# EAGLE schematic ext_proto_M (EAGLE 9.6.2)
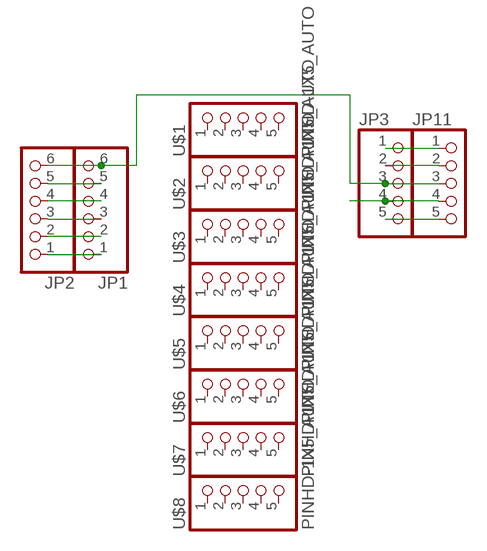
[diagram p0: schematic, sheet 1]

## Parts
JP1  PINHD-1X6  [1X06]
JP2  PINHD-1X6  [1X06]
JP3  PINHD-1X5  [1X05]
JP11  PINHD-1X5  [1X05]
U$1  PINHD-1X5_AUTO  [1X5_AUTO]
U$2  PINHD-1X5_AUTO  [1X5_AUTO]
U$3  PINHD-1X5_AUTO  [1X5_AUTO]
U$4  PINHD-1X5_AUTO  [1X5_AUTO]
U$5  PINHD-1X5_AUTO  [1X5_AUTO]
U$6  PINHD-1X5_AUTO  [1X5_AUTO]
U$7  PINHD-1X5_AUTO  [1X5_AUTO]
U$8  PINHD-1X5_AUTO  [1X5_AUTO]

## Nets
GND: JP1.6 JP2.6 JP3.3 JP11.3
N$1: JP1.5 JP2.5
N$2: JP1.4 JP2.4
N$3: JP1.3 JP2.3
N$4: JP1.2 JP2.2
N$5: JP1.1 JP2.1
N$6: JP3.5 JP11.5
N$7: JP3.2 JP11.2
N$8: JP3.1 JP11.1
VDD: JP3.4 JP11.4
Unconnected: U$1.1 U$1.2 U$1.3 U$1.4 U$1.5 U$2.1 U$2.2 U$2.3 U$2.4 U$2.5 U$3.1 U$3.2 U$3.3 U$3.4 U$3.5 U$4.1 U$4.2 U$4.3 U$4.4 U$4.5 U$5.1 U$5.2 U$5.3 U$5.4 U$5.5 U$6.1 U$6.2 U$6.3 U$6.4 U$6.5 U$7.1 U$7.2 U$7.3 U$7.4 U$7.5 U$8.1 U$8.2 U$8.3 U$8.4 U$8.5

## Library data of the parts
JP1 JP2 = pinhead2:PINHD-1X6: PIN HEADER
JP3 JP11 = pinhead2:PINHD-1X5: PIN HEADER
U$1-U$8 = pinhead2:PINHD-1X5_AUTO